# EAGLE design SensorHubSchematic (EAGLE 7.2.0)
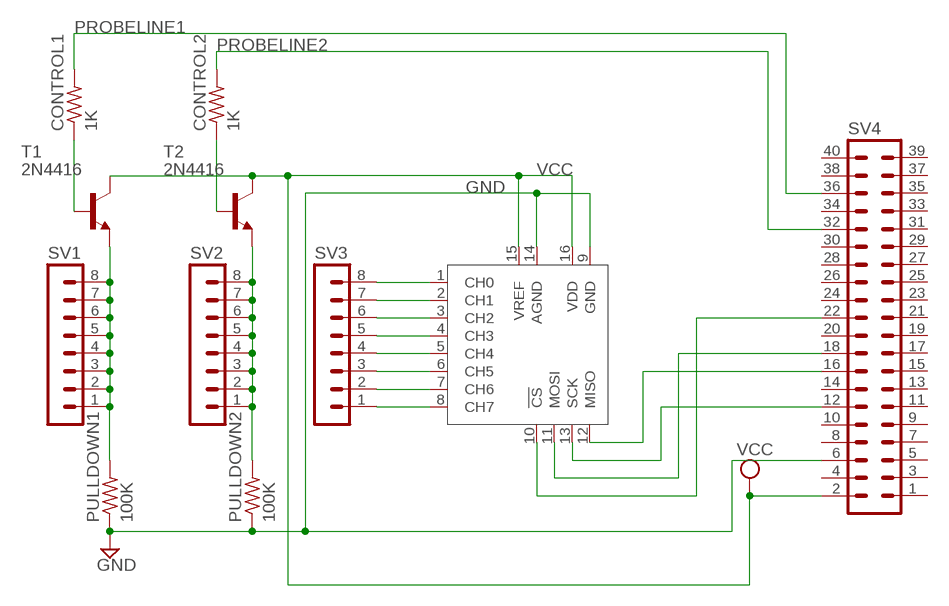
[diagram p0: schematic, sheet 1]

## Parts
CONTROL1  1K  R-US_0207/10  [0207/10]
CONTROL2  1K  R-US_0207/10  [0207/10]
PULLDOWN1  100K  R-US_0207/10  [0207/10]
PULLDOWN2  100K  R-US_0207/10  [0207/10]
SV1  MA08-1  [MA08-1]
SV2  MA08-1  [MA08-1]
SV3  MA08-1  [MA08-1]
SV4  MA20-2  [MA20-2]
T1  2N4416  [TO92]
T2  2N4416  [TO92]
U$1  MCP3008P  [DIL16]

## Nets
GND: PULLDOWN1.1 PULLDOWN2.1 SV4.6 U$1.9(GND) U$1.14(AGND)
N$1: PULLDOWN1.2 SV1.1 SV1.2 SV1.3 SV1.4 SV1.5 SV1.6 SV1.7 SV1.8 T1.3(E)
N$2: PULLDOWN2.2 SV2.1 SV2.2 SV2.3 SV2.4 SV2.5 SV2.6 SV2.7 SV2.8 T2.3(E)
N$4: SV3.1 U$1.8(CH7)
N$5: SV3.2 U$1.7(CH6)
N$6: SV3.3 U$1.6(CH5)
N$7: SV3.4 U$1.5(CH4)
N$8: SV3.5 U$1.4(CH3)
N$9: SV3.6 U$1.3(CH2)
N$10: SV3.7 U$1.2(CH1)
N$11: SV3.8 U$1.1(CH0)
N$13: CONTROL1.1 T1.2(B)
N$14: CONTROL2.1 T2.2(B)
N$17: SV4.18 U$1.11(MOSI)
N$18: SV4.22 U$1.10(!CS)
N$19: SV4.12 U$1.13(SCK)
N$20: SV4.16 U$1.12(MISO)
PROBELINE1: CONTROL1.2 SV4.36
PROBELINE2: CONTROL2.2 SV4.32
VCC: SV4.2 T1.1(C) T2.1(C) U$1.15(VREF) U$1.16(VDD)
Unconnected: SV4.1 SV4.3 SV4.4 SV4.5 SV4.7 SV4.8 SV4.9 SV4.10 SV4.11 SV4.13 SV4.14 SV4.15 SV4.17 SV4.19 SV4.20 SV4.21 SV4.23 SV4.24 SV4.25 SV4.26 SV4.27 SV4.28 SV4.29 SV4.30 SV4.31 SV4.33 SV4.34 SV4.35 SV4.37 SV4.38 SV4.39 SV4.40

## Library data of the parts
CONTROL1 CONTROL2 PULLDOWN1 PULLDOWN2 = rcl:R-US_: RESISTOR, American symbol
SV1-SV3 = con-lstb:MA08-1: PIN HEADER; OC_FARNELL: unknown; OC_NEWARK: unknown
SV4 = con-lstb:MA20-2: PIN HEADER; OC_FARNELL: unknown; OC_NEWARK: unknown
T1 T2 = transistor-neu-to92:2N4416: NPN TRANSISTOR
U$1 = MCP3008:MCP3008

## Board
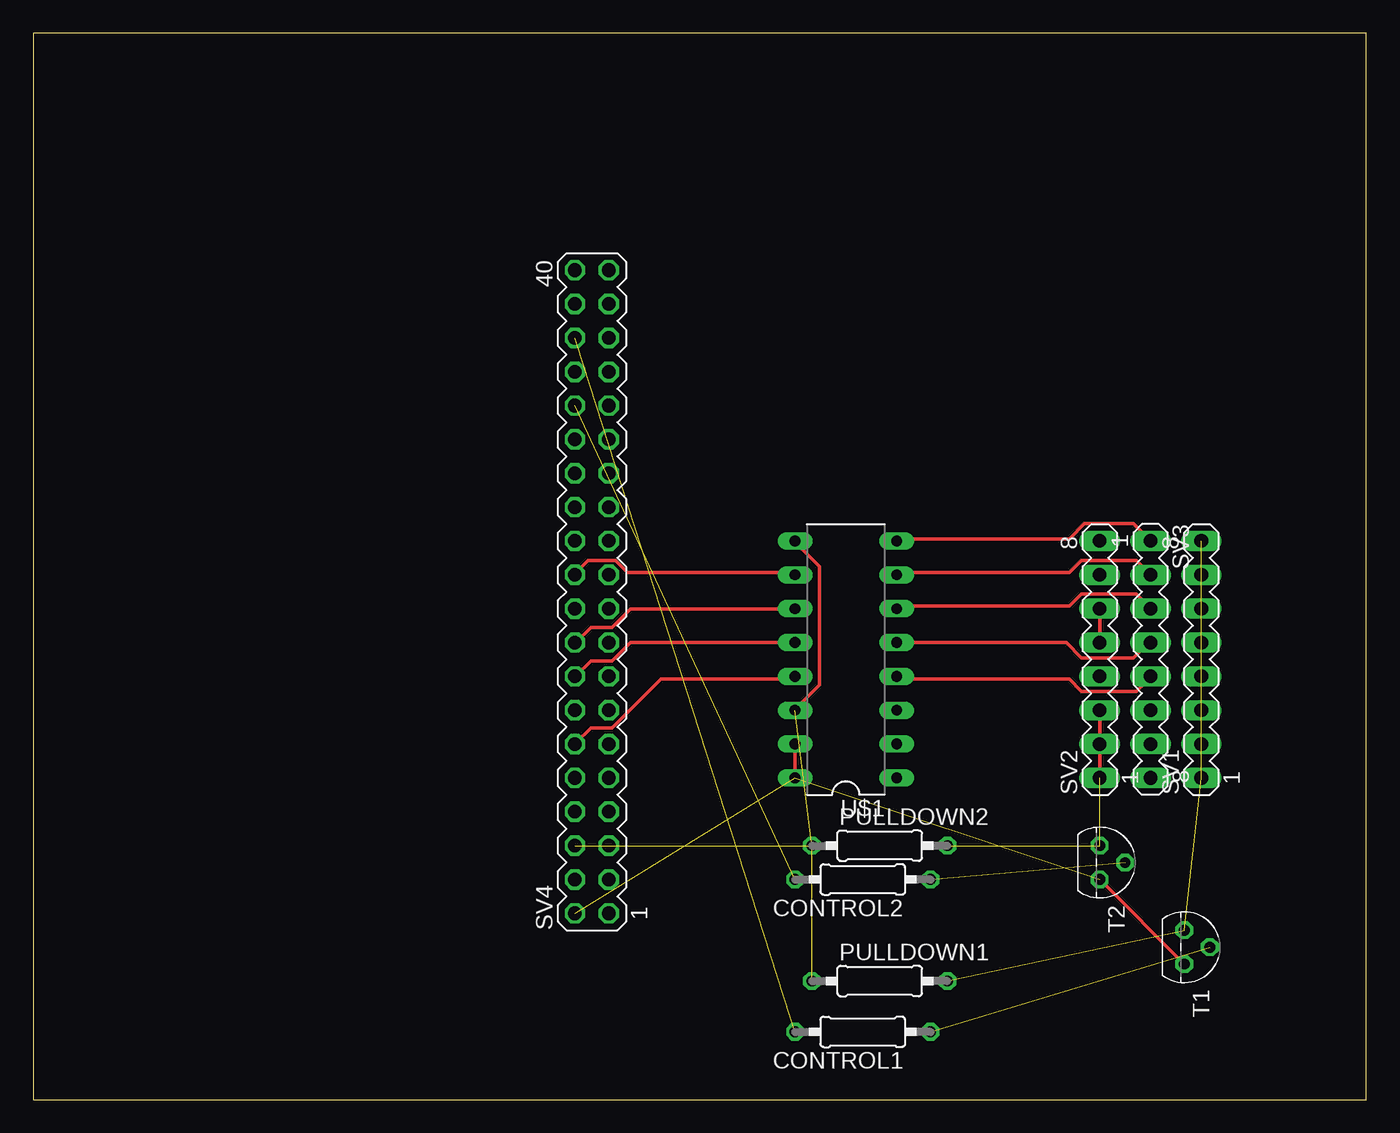
[diagram p1: board, top side]
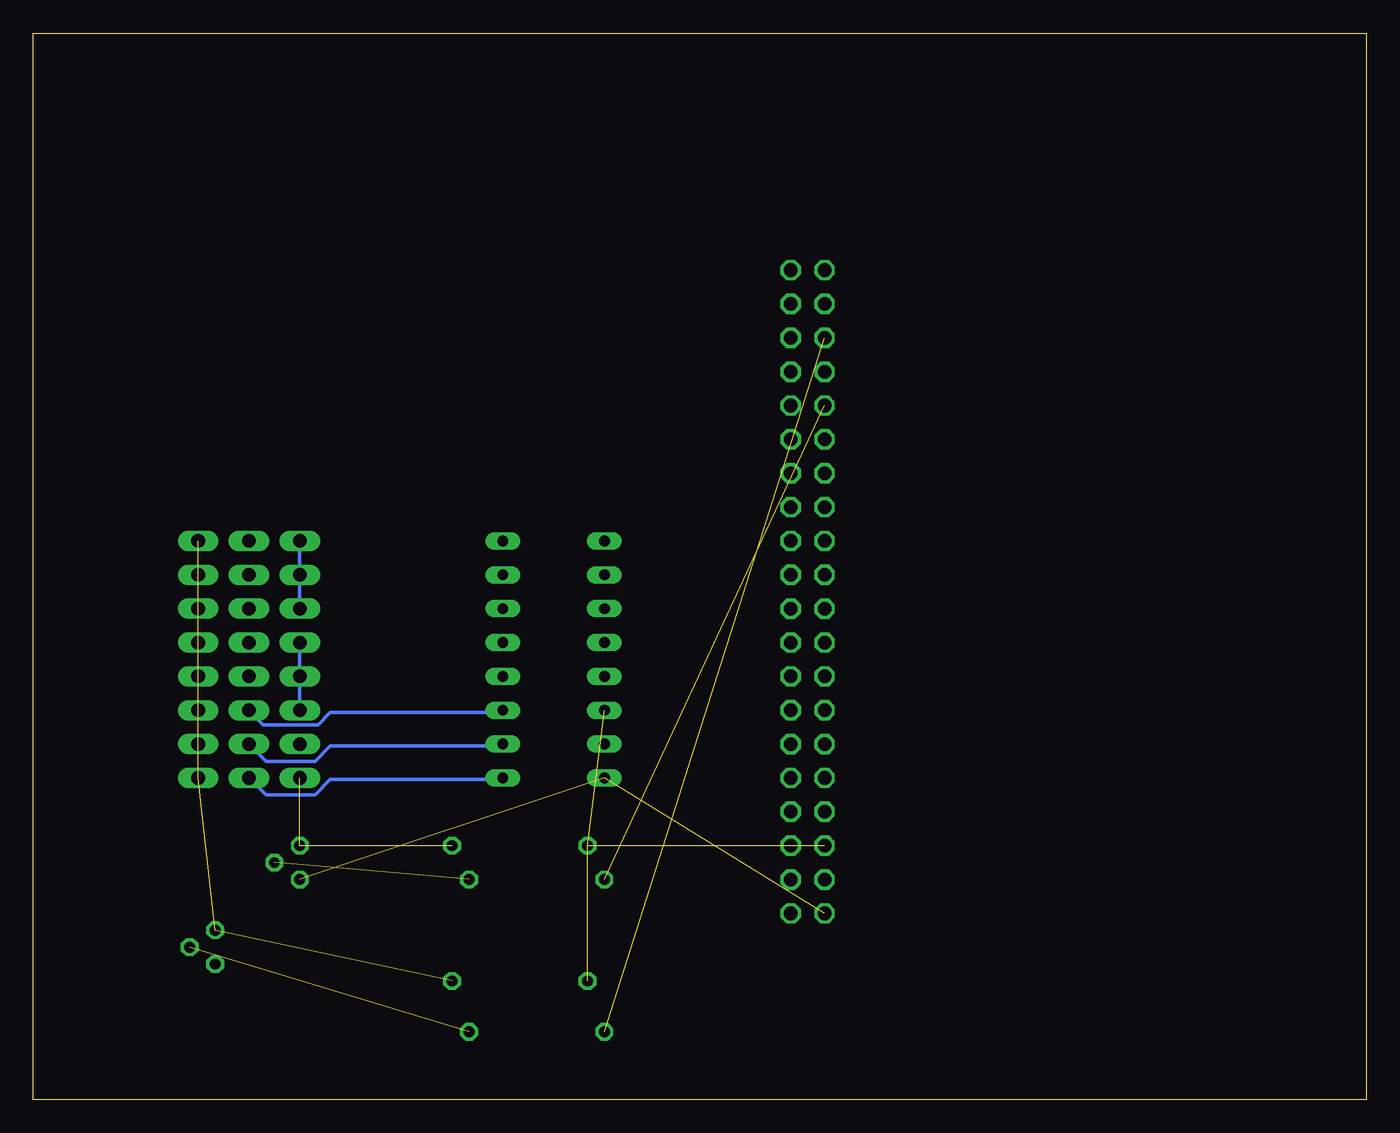
[diagram p2: board, bottom side, seen from below]

Size 100 x 80 mm. Coordinates in mm from the lower left corner, seen from the top.
Outline: 0,0 100,0 100,80 0,80 0,0
Copper layers (1*16): Top 0.035mm / dielectric 1.5mm / Bottom 0.035mm
Design rules "default": minimum track width 10mil, minimum drill 24mil, track to track 8mil, track to pad 8mil, pad to pad 8mil, via to via 8mil, smd to smd 8mil, copper to edge 40mil, drill to drill 8mil, minimum pad ring 10mil, minimum via ring 8mil, stop-mask expansion 4mil, vias tented up to drill 0mil, thermal gap 10mil

### Footprints (pad centres in the part's own frame; a part is rotated, then mirrored left to right if it is on the bottom)
0207/10 = drill 0.813 octagon: 1 -5.08,0; 2 5.08,0
MA08-1 = drill 1.016 long: 1 -8.89,0; 2 -6.35,0; 3 -3.81,0; 4 -1.27,0; 5 1.27,0; 6 3.81,0; 7 6.35,0; 8 8.89,0
MA20-2 = drill 1.016 octagon: 1 -24.13,-1.27; 2 -24.13,1.27; 3 -21.59,-1.27; 4 -21.59,1.27; 5 -19.05,-1.27; 6 -19.05,1.27; 7 -16.51,-1.27; 8 -16.51,1.27; 9 -13.97,-1.27; 10 -13.97,1.27; 11 -11.43,-1.27; 12 -11.43,1.27; 13 -8.89,-1.27; 14 -8.89,1.27; 15 -6.35,-1.27; 16 -6.35,1.27; 17 -3.81,-1.27; 18 -3.81,1.27; 19 -1.27,-1.27; 20 -1.27,1.27; 21 1.27,-1.27; 22 1.27,1.27; 23 3.81,-1.27; 24 3.81,1.27; 25 6.35,-1.27; 26 6.35,1.27; 27 8.89,-1.27; 28 8.89,1.27; 29 11.43,-1.27; 30 11.43,1.27; 31 13.97,-1.27; 32 13.97,1.27; 33 16.51,-1.27; 34 16.51,1.27; 35 19.05,-1.27; 36 19.05,1.27; 37 21.59,-1.27; 38 21.59,1.27; 39 24.13,-1.27; 40 24.13,1.27
TO92 = drill 0.813 octagon: 1 1.27,0; 2 0,1.905; 3 -1.27,0
DIL16 = drill 0.813 long: 1 -8.89,-3.81; 2 -6.35,-3.81; 3 -3.81,-3.81; 4 -1.27,-3.81; 5 1.27,-3.81; 6 3.81,-3.81; 7 6.35,-3.81; 8 8.89,-3.81; 9 8.89,3.81; 10 6.35,3.81; 11 3.81,3.81; 12 1.27,3.81; 13 -1.27,3.81; 14 -3.81,3.81; 15 -6.35,3.81; 16 -8.89,3.81

### Placement (x,y rotation side)
CONTROL1  62.23,5.08 180 top
CONTROL2  62.23,16.51 180 top
PULLDOWN1  63.5,8.89 0 top
PULLDOWN2  63.5,19.05 0 top
SV1  87.63,33.02 90 top
SV2  80.01,33.02 90 top
SV3  83.82,33.02 270 top
SV4  41.91,38.1 90 top
T1  86.36,11.43 270 top
T2  80.01,17.78 270 top
U$1  60.96,33.02 90 top

### Tracks (layer width: path | path; a pad name or v marks a point on that pad's centre or on a via)
GND  (3 unrouted)
  Top 0.254: U$1.9 57.15,41.83 58.98,40.01 58.98,31.09 57.15,29.26 U$1.14
N$1  (9 unrouted)
N$2  (2 unrouted)
  Top 0.254: SV2.6 SV2.5 | SV2.1 SV2.2 SV2.3
  Bottom 0.254: SV2.6 SV2.7 SV2.8 | SV2.3 SV2.4 SV2.5
N$4
  Top 0.254: SV3.1 82.53,43.2 78.87,43.2 77.72,42.06 64.92,42.06 U$1.8
N$5
  Top 0.254: U$1.7 64.92,39.55 77.72,39.55 78.64,40.46 82.75,40.46 83.67,39.55 SV3.2
N$6
  Top 0.254: U$1.6 64.92,37.03 77.72,37.03 78.64,37.95 82.75,37.95 83.67,37.03 SV3.3
N$7
  Top 0.254: U$1.5 77.5,34.29 78.64,33.15 82.53,33.15 83.67,34.29 SV3.4
N$8
  Top 0.254: U$1.4 64.92,31.55 77.72,31.55 78.64,30.63 82.75,30.63 83.67,31.55 SV3.5
N$9
  Bottom 0.254: U$1.3 64.92,29.03 77.72,29.03 78.64,28.12 82.75,28.12 83.67,29.03 SV3.6
N$10
  Bottom 0.254: SV3.7 82.53,25.38 78.87,25.38 77.72,26.52 64.92,26.52 U$1.2
N$11
  Bottom 0.254: U$1.1 64.92,24 77.72,24 78.87,22.86 82.53,22.86 83.67,24 SV3.8
N$13  (1 unrouted)
N$14  (1 unrouted)
N$17
  Top 0.254: U$1.11 57.15,36.8 44.81,36.8 43.43,35.43 41.83,35.43 40.69,34.29 SV4.18
N$18
  Top 0.254: U$1.10 57.15,39.55 44.58,39.55 43.66,40.46 41.6,40.46 40.69,39.55 SV4.22
N$19
  Top 0.254: U$1.13 57.15,31.55 47.09,31.55 43.43,27.89 41.83,27.89 40.69,26.75 SV4.12
N$20
  Top 0.254: U$1.12 44.81,34.29 43.43,32.92 41.83,32.92 40.69,31.77 SV4.16
PROBELINE1  (1 unrouted)
PROBELINE2  (1 unrouted)
VCC  (2 unrouted)
  Top 0.254: T1.1 T2.1 | U$1.15 U$1.16